# EAGLE design RotaryConnector_A (EAGLE 9.6.2)
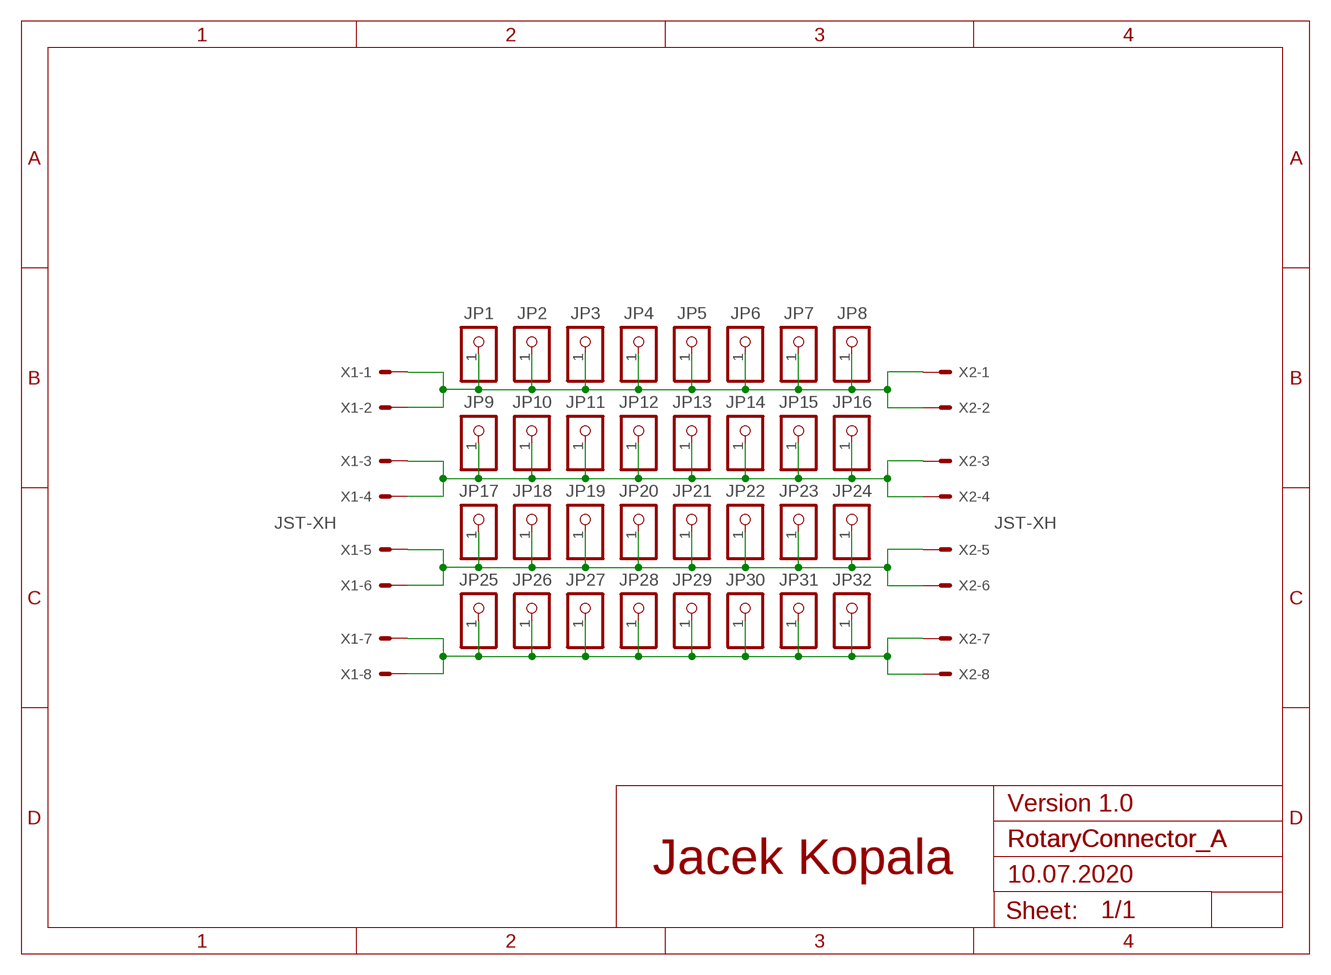
[diagram p0: schematic, sheet 1]

## Parts
JP1  PINHD-1X1  [1X01]
JP2  PINHD-1X1  [1X01]
JP3  PINHD-1X1  [1X01]
JP4  PINHD-1X1  [1X01]
JP5  PINHD-1X1  [1X01]
JP6  PINHD-1X1  [1X01]
JP7  PINHD-1X1  [1X01]
JP8  PINHD-1X1  [1X01]
JP9  PINHD-1X1  [1X01]
JP10  PINHD-1X1  [1X01]
JP11  PINHD-1X1  [1X01]
JP12  PINHD-1X1  [1X01]
JP13  PINHD-1X1  [1X01]
JP14  PINHD-1X1  [1X01]
JP15  PINHD-1X1  [1X01]
JP16  PINHD-1X1  [1X01]
JP17  PINHD-1X1  [1X01]
JP18  PINHD-1X1  [1X01]
JP19  PINHD-1X1  [1X01]
JP20  PINHD-1X1  [1X01]
JP21  PINHD-1X1  [1X01]
JP22  PINHD-1X1  [1X01]
JP23  PINHD-1X1  [1X01]
JP24  PINHD-1X1  [1X01]
JP25  PINHD-1X1  [1X01]
JP26  PINHD-1X1  [1X01]
JP27  PINHD-1X1  [1X01]
JP28  PINHD-1X1  [1X01]
JP29  PINHD-1X1  [1X01]
JP30  PINHD-1X1  [1X01]
JP31  PINHD-1X1  [1X01]
JP32  PINHD-1X1  [1X01]
X1  JST-XH  JST-XH-08-PIN-LONG-PAD  [JST-XH-08-PACKAGE-LONG-PAD]
X2  JST-XH  JST-XH-08-PIN-LONG-PAD  [JST-XH-08-PACKAGE-LONG-PAD]

## Nets
SIG1: JP1.1 JP2.1 JP3.1 JP4.1 JP5.1 JP6.1 JP7.1 JP8.1 X1.1 X1.2 X2.1 X2.2
SIG2: JP9.1 JP10.1 JP11.1 JP12.1 JP13.1 JP14.1 JP15.1 JP16.1 X1.3 X1.4 X2.3 X2.4
SIG3: JP17.1 JP18.1 JP19.1 JP20.1 JP21.1 JP22.1 JP23.1 JP24.1 X1.5 X1.6 X2.5 X2.6
SIG4: JP25.1 JP26.1 JP27.1 JP28.1 JP29.1 JP30.1 JP31.1 JP32.1 X1.7 X1.8 X2.7 X2.8

## Notes on the sheet
- Version 1.0
- RotaryConnector_A
- Jacek Kopala
- 10.07.2020

## Library data of the parts
JP1-JP32 = pinhead:PINHD-1X1: PIN HEADER
X1 X2 = con-JST XH:JST-XH-08-PIN: JST XH Connector 2 Pin Wire to board connector. Pitch: 2,54 mm, (0.100") Number of pins: 8 Created by Rembrandt Electronics www.rembrandtelectronics.com

## Board
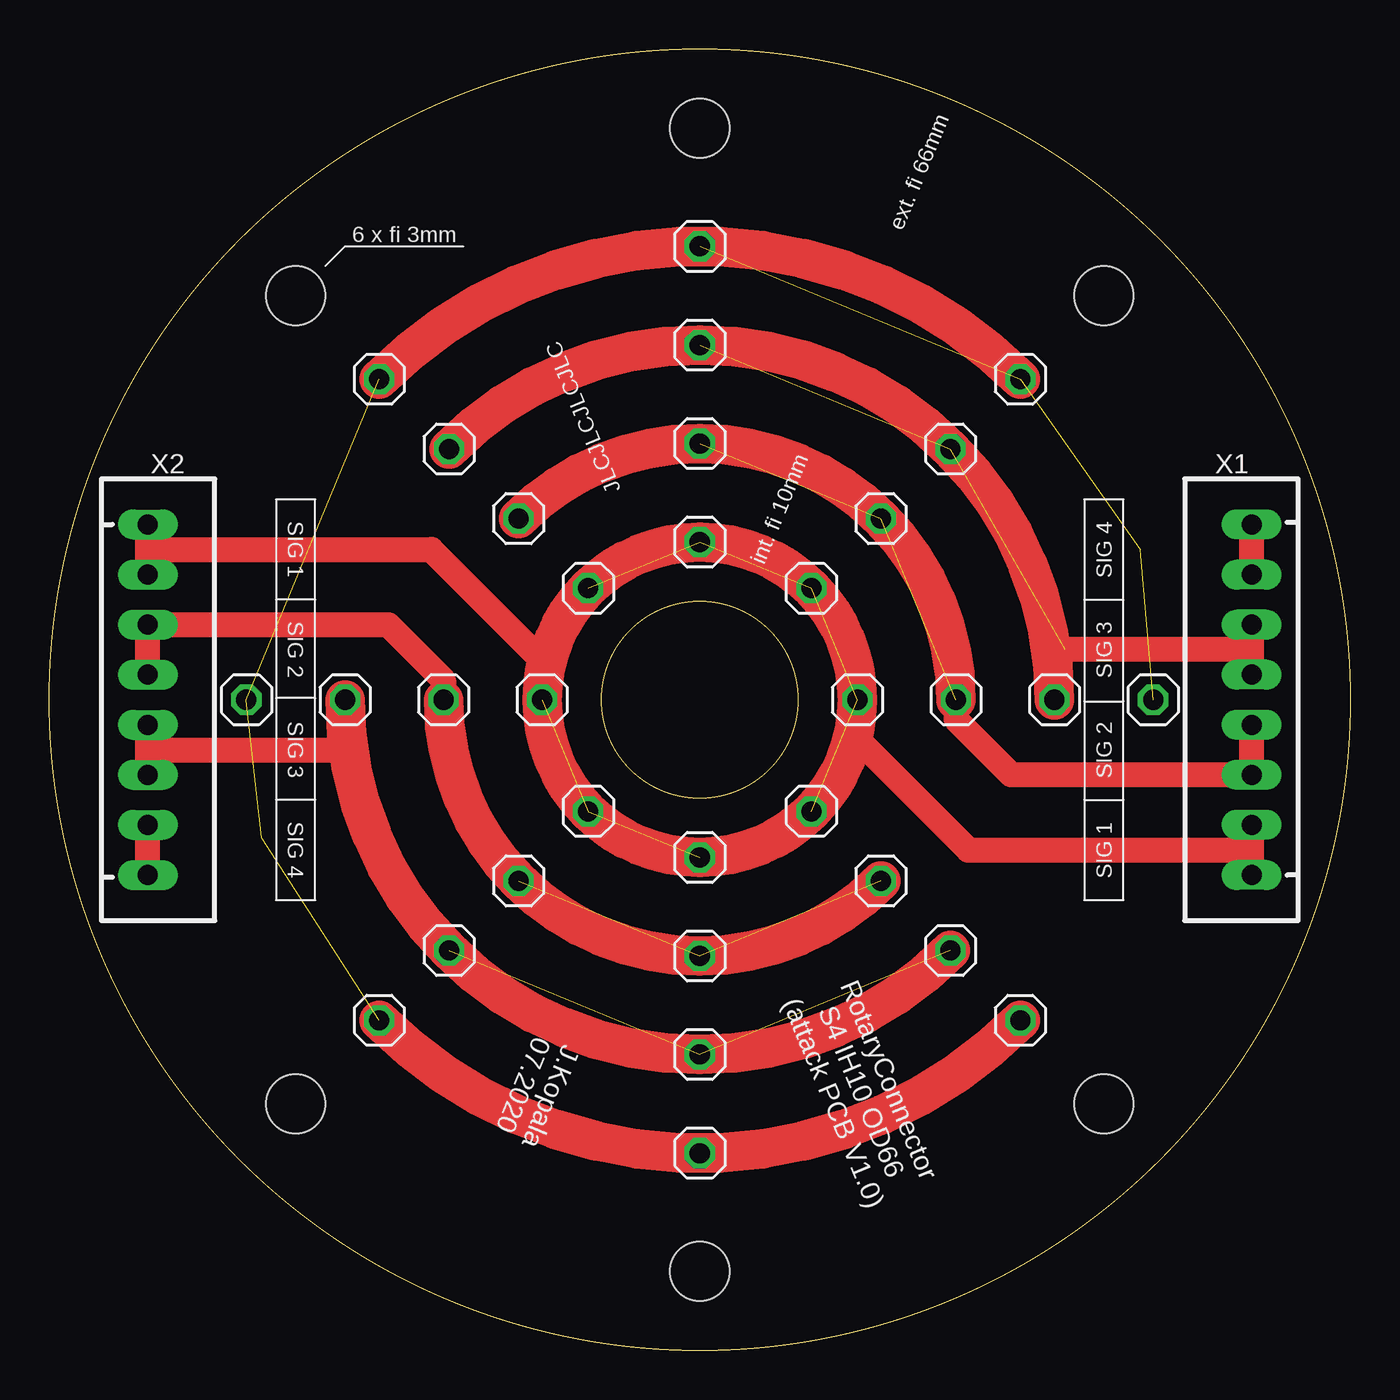
[diagram p1: board, top side]
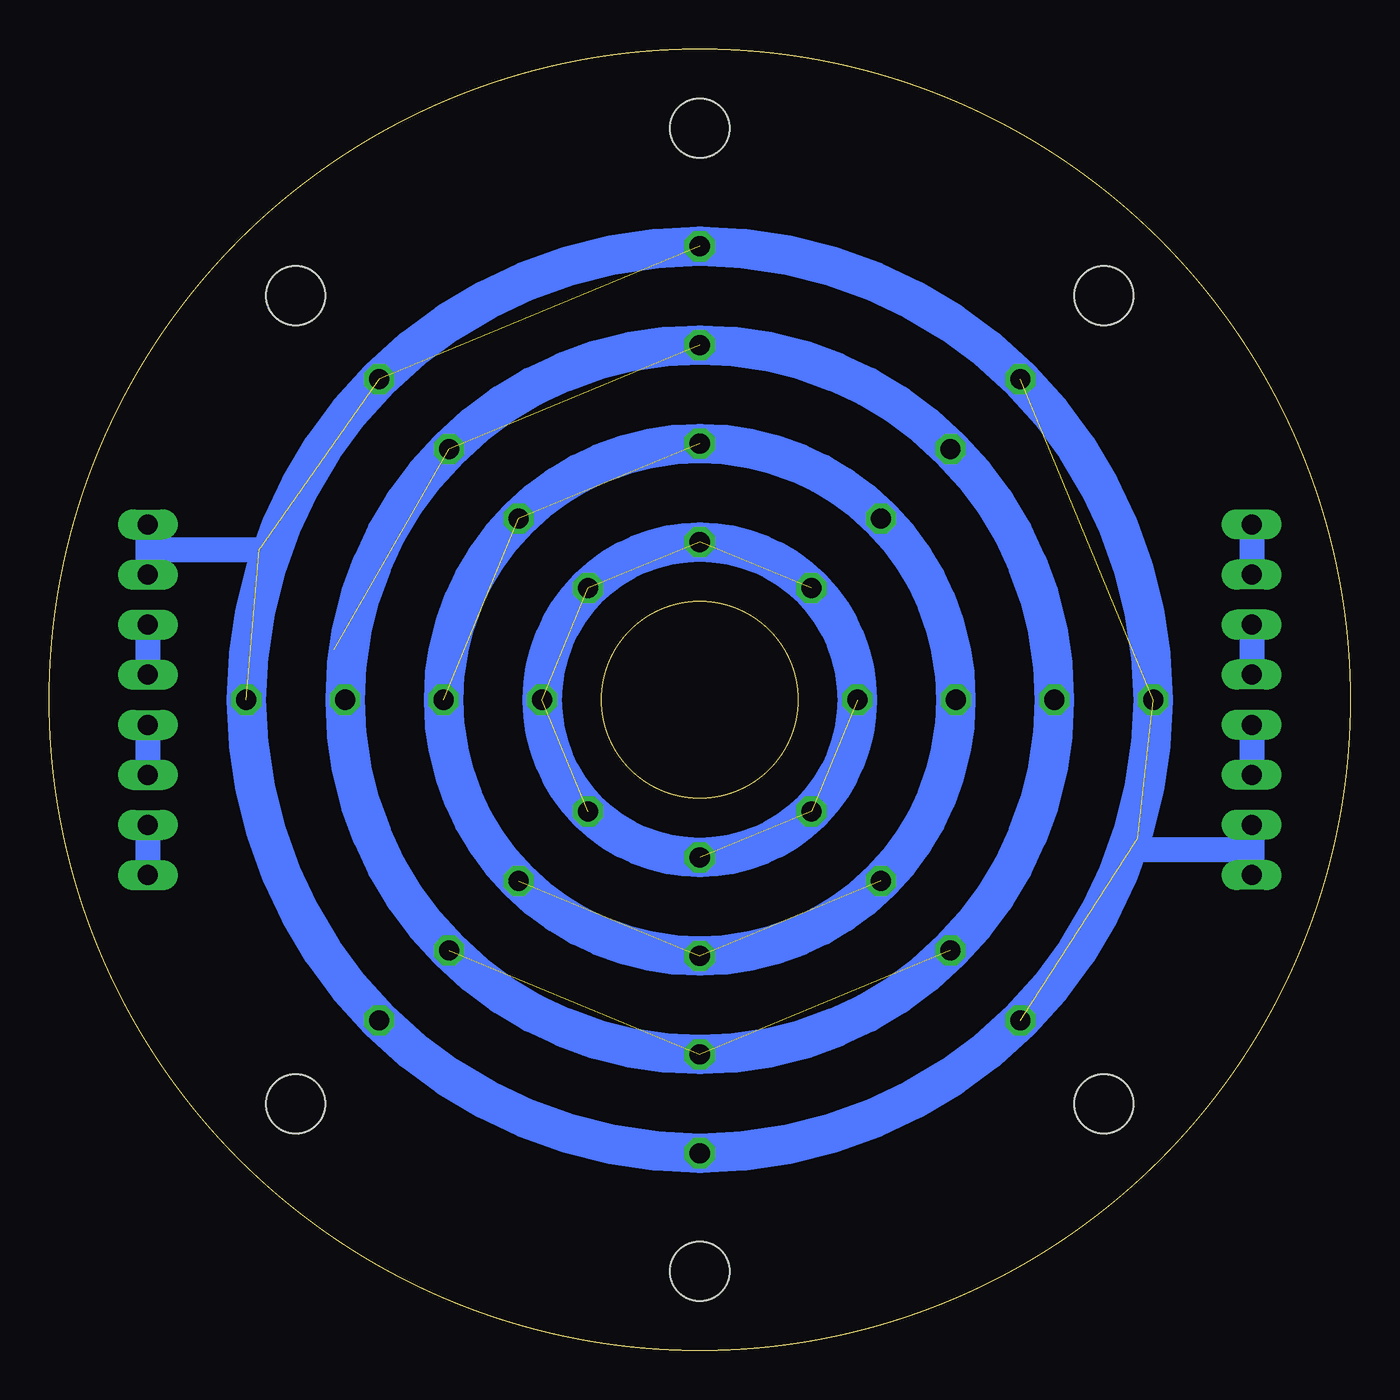
[diagram p2: board, bottom side, seen from below]

Size 66 x 66 mm. Coordinates in mm from the lower left corner, seen from the top.
Outline: circle at 33,33 radius 5
Outline: circle at 33,33 radius 33
Copper layers (1*16): Top 0.035mm / dielectric 1.5mm / Bottom 0.035mm
Design rules "default": minimum track width 6mil, minimum drill 0.35mm, track to track 6mil, track to pad 6mil, pad to pad 6mil, via to via 6mil, smd to smd 6mil, copper to edge 40mil, drill to drill 6mil, minimum pad ring 10mil, minimum via ring 8mil, stop-mask expansion 4mil, vias tented up to drill 0mil, thermal gap 10mil
Holes 3 mm at 33,4 33,62 12.49,53.51 53.51,53.51 12.49,12.49 53.51,12.49

### Footprints (pad centres in the part's own frame; a part is rotated, then mirrored left to right if it is on the bottom)
1X01 = drill 1.016 octagon: 1 0,0
JST-XH-08-PACKAGE-LONG-PAD = drill 1.016 long: 1 -8.89,0; 2 -6.35,0; 3 -3.81,0; 4 -1.27,0; 5 1.27,0; 6 3.81,0; 7 6.35,0; 8 8.89,0

### Placement (x,y rotation side)
JP1  33,41 0 top
JP2  38.66,38.66 0 top
JP3  41,33 0 top
JP4  38.66,27.34 0 top
JP5  33,25 0 top
JP6  27.34,27.34 0 top
JP7  25,33 0 top
JP8  27.34,38.66 0 top
JP9  33,46 0 top
JP10  42.19,42.19 0 top
JP11  46,33 0 top
JP12  42.19,23.81 0 top
JP13  33,20 0 top
JP14  23.81,23.81 0 top
JP15  20,33 0 top
JP16  23.81,42.19 0 top
JP17  33,51 0 top
JP18  45.73,45.73 0 top
JP19  51,33 0 top
JP20  45.73,20.27 0 top
JP21  33,15 0 top
JP22  20.27,20.27 0 top
JP23  15,33 0 top
JP24  20.27,45.73 0 top
JP25  33,56 0 top
JP26  49.26,49.26 0 top
JP27  56,33 0 top
JP28  49.26,16.74 0 top
JP29  33,10 0 top
JP30  16.74,16.74 0 top
JP31  10,33 0 top
JP32  16.74,49.26 0 top
X1  61,33 90 top
X2  5,33 270 top

### Tracks (layer width: path | path; a pad name or v marks a point on that pad's centre or on a via)
SIG1  (6 unrouted)
  Top 1.27: X1.1 61,25.38 | 61,25.38 X1.2 | X2.2 5,40.62 | 5,40.62 X2.1 | JP3.1 41,31 46.62,25.38 61,25.38 | JP7.1 25,35 19.38,40.62 5,40.62
  Top 2: JP1.1 arc-180 JP5.1 arc-180 JP1.1
  Bottom 1.27: X1.2 X1.1 | X2.1 X2.2
  Bottom 2: JP5.1 arc-180 JP1.1 arc-180 JP5.1
SIG2  (4 unrouted)
  Top 1.27: X1.4 X1.3 48.81,29.19 46,32 JP11.1 | X2.4 X2.3 17.19,36.81 20,34 JP15.1
  Top 2: JP16.1 arc-135 JP11.1 | JP12.1 arc-135 JP15.1
  Bottom 1.27: X1.4 X1.3 | X2.3 X2.4
  Bottom 2: JP9.1 arc-180 JP13.1 arc-180 JP9.1
SIG3  (4 unrouted)
  Top 1.27: X1.5 61,35.54 | 61,35.54 X1.6 | X2.6 5,30.46 | 5,30.46 X2.5 | 61,35.54 51.54,35.54 51,35 JP19.1 | 5,30.46 14.46,30.46 15,31 JP23.1
  Top 2: JP24.1 arc-135 JP19.1 | JP20.1 arc-135 JP23.1
  Bottom 1.27: X1.6 X1.5 | X2.5 X2.6
  Bottom 2: JP17.1 arc-180 JP21.1 arc-180 JP17.1
SIG4  (6 unrouted)
  Top 1.27: X1.7 X1.8 | X2.8 X2.7
  Top 2: JP32.1 arc-90 JP26.1 | JP28.1 arc-90 JP30.1
  Bottom 1.27: X1.8 61,40.62 | 61,40.62 X1.7 | X2.7 5,25.38 | 5,25.38 X2.8 | 61,40.62 55.35,40.62 | 5,25.38 10.77,25.38 10.77,26
  Bottom 2: JP25.1 arc-180 JP29.1 arc-180 JP25.1

### Text on the board
tPlace: ext. fi 66mm | 6 x fi 3mm | JLCJLCJLCJLC | int. fi 10mm | SIG 1 | SIG 4 | SIG 2 | SIG 3 | SIG 3 | SIG 2 | SIG 4 | SIG 1 | J.Kopala / 07.2020 | RotaryConnector / S4 IH10 OD66 / (attack PCB V1.0)